# EAGLE design bms (EAGLE 4.13)
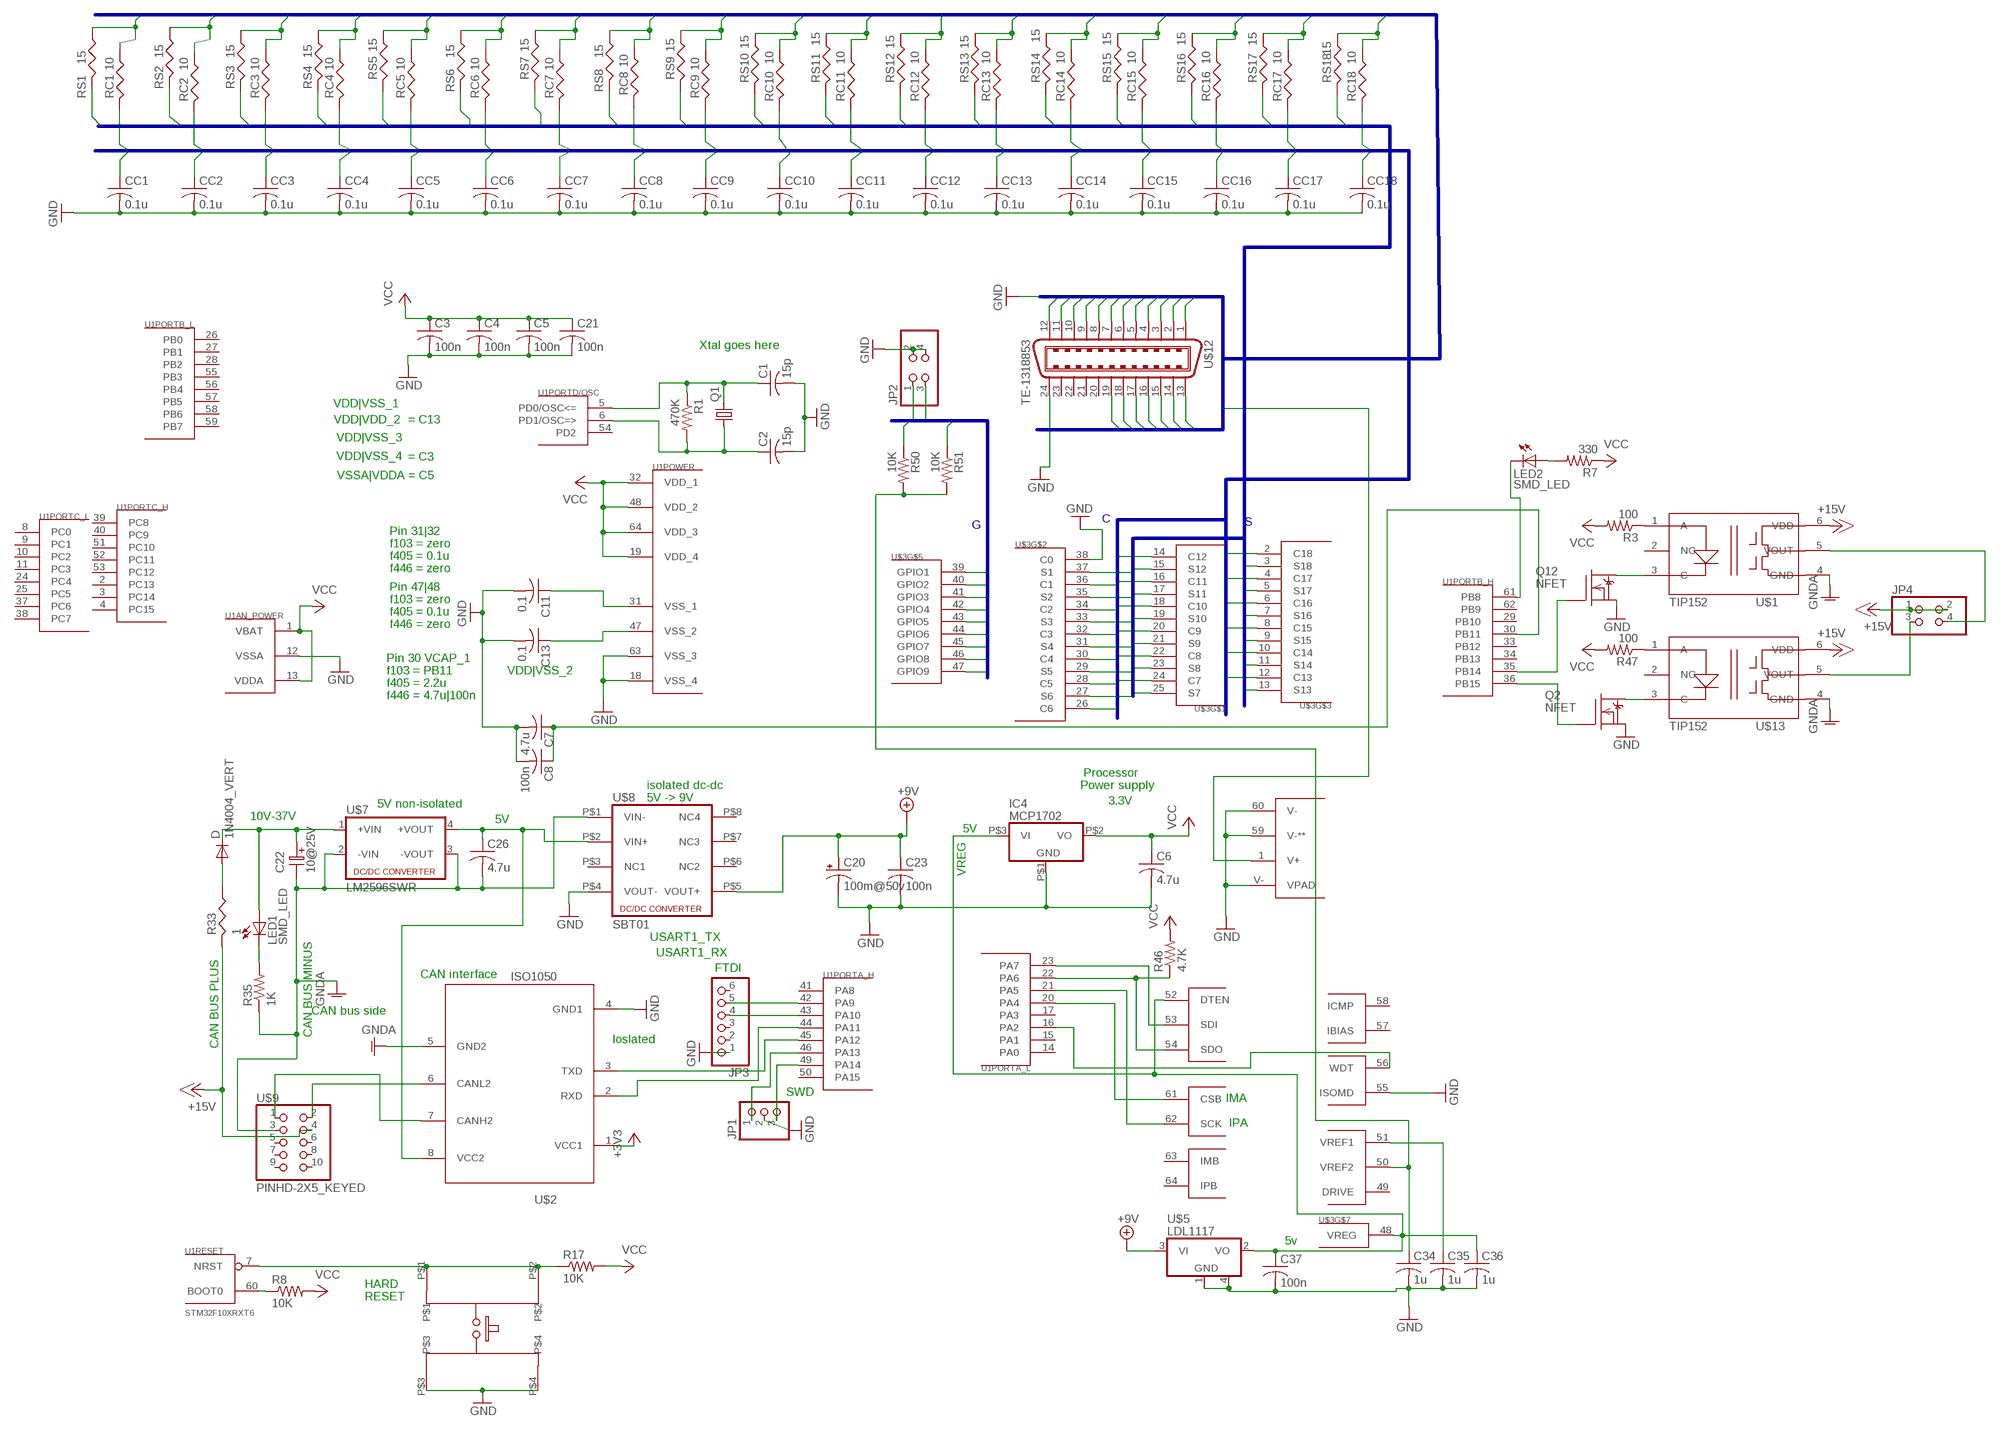
[diagram p0: schematic, sheet 1]

## Parts
C1  15p  C-USC0603  [C0603]
C2  15p  C-USC0603  [C0603]
C3  100n  C-USC0603  [C0603]
C4  100n  C-USC0603  [C0603]
C5  100n  C-USC0603  [C0603]
C6  4.7u  C-USC0805  [C0805]
C7  4.7u  C-USC0603  [C0603]
C8  100n  C-USC0603  [C0603]
C11  0.1  C-USC0603  [C0603]
C13  0.1  C-USC0603  [C0603]
C20  100m@50v  CPOL-USE5-8.5  [E5-8,5]
C21  100n  C-USC0603  [C0603]
C22  10@25V  ELC-2,5L  [ES-2,5L]
C23  100n  C-USC0603  [C0603]
C26  4.7u  C-USC0603  [C0603]
C34  1u  C-USC0603  [C0603]
C35  1u  C-USC0603  [C0603]
C36  1u  C-USC0603  [C0603]
C37  100n  C-USC0603  [C0603]
CC1  0.1u  C-USC0805  [C0805]
CC2  0.1u  C-USC0805  [C0805]
CC3  0.1u  C-USC0805  [C0805]
CC4  0.1u  C-USC0805  [C0805]
CC5  0.1u  C-USC0805  [C0805]
CC6  0.1u  C-USC0805  [C0805]
CC7  0.1u  C-USC0805  [C0805]
CC8  0.1u  C-USC0805  [C0805]
CC9  0.1u  C-USC0805  [C0805]
CC10  0.1u  C-USC0805  [C0805]
CC11  0.1u  C-USC0805  [C0805]
CC12  0.1u  C-USC0805  [C0805]
CC13  0.1u  C-USC0805  [C0805]
CC14  0.1u  C-USC0805  [C0805]
CC15  0.1u  C-USC0805  [C0805]
CC16  0.1u  C-USC0805  [C0805]
CC17  0.1u  C-USC0805  [C0805]
CC18  0.1u  C-USC0805  [C0805]
D  1N4004_VERT  [DO41-10_VERT]
IC4  MCP1702  [SOT-23A]
JP1  PINHD-1X3  [1X03]
JP2  PINHD-2X2  [2X02]
JP3  PINHD-1X6  [1X06]
JP4  PINHD-2X2  [2X02]
LED1  SMD_LED  [SMD_LED]
LED2  SMD_LED  [SMD_LED]
Q1  CRYTALHC49S  [HC49/S]
Q2  NFET  DMN3404L  [SOT-23]
Q12  NFET  DMN3404L  [SOT-23]
R1  470K  R-US_R0603  [R0603]
R3  100  R-US_R0603  [R0603]
R7  330  R-US_R0603  [R0603]
R8  10K  R-US_R0603  [R0603]
R17  10K  R-US_R0603  [R0603]
R33  1  RESUS-S2,5  [RS-2,5]
R35  1K  R-US_R0603  [R0603]
R46  4.7K  R-US_R0603  [R0603]
R47  100  R-US_R0603  [R0603]
R50  10K  R-US_R0603  [R0603]
R51  10K  R-US_R0603  [R0603]
RC1  10  RESUS-S2,5  [RS-2,5]
RC2  10  RESUS-S2,5  [RS-2,5]
RC3  10  RESUS-S2,5  [RS-2,5]
RC4  10  RESUS-S2,5  [RS-2,5]
RC5  10  RESUS-S2,5  [RS-2,5]
RC6  10  RESUS-S2,5  [RS-2,5]
RC7  10  RESUS-S2,5  [RS-2,5]
RC8  10  RESUS-S2,5  [RS-2,5]
RC9  10  RESUS-S2,5  [RS-2,5]
RC10  10  RESUS-S2,5  [RS-2,5]
RC11  10  RESUS-S2,5  [RS-2,5]
RC12  10  RESUS-S2,5  [RS-2,5]
RC13  10  RESUS-S2,5  [RS-2,5]
RC14  10  RESUS-S2,5  [RS-2,5]
RC15  10  RESUS-S2,5  [RS-2,5]
RC16  10  RESUS-S2,5  [RS-2,5]
RC17  10  RESUS-S2,5  [RS-2,5]
RC18  10  RESUS-S2,5  [RS-2,5]
RS1  15  RESUS-S2,5  [RS-2,5]
RS2  15  RESUS-S2,5  [RS-2,5]
RS3  15  RESUS-S2,5  [RS-2,5]
RS4  15  RESUS-S2,5  [RS-2,5]
RS5  15  RESUS-S2,5  [RS-2,5]
RS6  15  RESUS-S2,5  [RS-2,5]
RS7  15  RESUS-S2,5  [RS-2,5]
RS8  15  RESUS-S2,5  [RS-2,5]
RS9  15  RESUS-S2,5  [RS-2,5]
RS10  15  RESUS-S2,5  [RS-2,5]
RS11  15  RESUS-S2,5  [RS-2,5]
RS12  15  RESUS-S2,5  [RS-2,5]
RS13  15  RESUS-S2,5  [RS-2,5]
RS14  15  RESUS-S2,5  [RS-2,5]
RS15  15  RESUS-S2,5  [RS-2,5]
RS16  15  RESUS-S2,5  [RS-2,5]
RS17  15  RESUS-S2,5  [RS-2,5]
RS18  15  RESUS-S2,5  [RS-2,5]
SW1  E-SWITCH  [E-SWITCH]
U1  STM32F10XRXT6  [TQFP64]
U$1  TIP152  SI826  [SDIP6]
U$2  ISO1050  [PDSO-G8]
U$3  LTC6813  [TQFP64_PAD]
U$5  LDL1117  [SO223]
U$7  LM2596SWR  [LM2596SW]
U$8  SBT01  [SBT01]
U$9  PINHD-2X5_KEYED  [2X05_KEYED]
U$12  TE-1318853  [TE-CONN-24]
U$13  TIP152  SI826  [SDIP6]

## Nets
5V_CANSIDE: C26.1 U$2.8(VCC2) U$7.4(+VOUT) U$8.P$2(VIN+)
+3V3: U$2.1(VCC1)
+9V: C20.+ C23.1 U$5.3(VI) U$8.P$5(VOUT+)
+12V_RESISTORED: D.A R33.1
+15V: JP4.1 JP4.2 R33.2 U$1.6(VDD) U$9.4 U$13.6(VDD)
BOOT0: R8.1 U1.60(RESET:BOOT0)
C1: CC1.1 RC1.2 U$3.36(C1)
C2: CC2.1 RC2.2 U$3.34(C2)
C3: CC3.1 RC3.2 U$3.32(C3)
C4: CC4.1 RC4.2 U$3.30(C4)
C5: CC5.1 RC5.2 U$3.28(C5)
C6: CC6.1 RC6.2 U$3.26(C6)
C7: CC7.1 RC7.2 U$3.24(C7)
C8: CC8.1 RC8.2 U$3.22(C8)
C9: CC9.1 RC9.2 U$3.20(C9)
C10: CC10.1 RC10.2 U$3.18(C10)
C11: CC11.1 RC11.2 U$3.16(C11)
C12: CC12.1 RC12.2 U$3.14(C12)
C13: CC13.1 RC13.2 U$3.12(C13)
C14: CC14.1 RC14.2 U$3.10(C14)
C15: CC15.1 RC15.2 U$3.8(C15)
C16: CC16.1 RC16.2 U$3.6(C16)
C17: CC17.1 RC17.2 U$3.4(C17)
C18: CC18.1 RC18.2 U$3.2(C18)
CAN_PROTECTED+: C22.1 D.C LED1.A U$7.1(+VIN)
CANH: U$2.7(CANH2) U$9.1
CANL: U$2.6(CANL2) U$9.2
G1: JP2.1 R50.1 U$3.39(GPIO1)
G2: JP2.3 R51.1 U$3.40(GPIO2)
G3: U$3.41(GPIO3)
G4: U$3.42(GPIO4)
G5: U$3.43(GPIO5)
G6: U$3.44(GPIO6)
G7: U$3.45(GPIO7)
G8: U$3.46(GPIO8)
G9: U$3.47(GPIO9)
GND: C1.2 C2.2 C3.2 C4.2 C5.2 C6.2 C7.2 C8.2 C11.2 C13.2 C20.- C21.2 C23.2 C34.2 C35.2 C36.2 C37.2 CC1.2 CC2.2 CC3.2 CC4.2 CC5.2 CC6.2 CC7.2 CC8.2 CC9.2 CC10.2 CC11.2 CC12.2 CC13.2 CC14.2 CC15.2 CC16.2 CC17.2 CC18.2 IC4.P$1(GND) JP1.2 JP2.2 JP2.4 JP3.1 Q2.2(S) Q12.2(S) SW1.P$3 SW1.P$4 U1.12(AN_POWER:VSSA) U1.18(POWER:VSS_4) U1.63(POWER:VSS_3) U$2.4(GND1) U$3.38(C0) U$3.55(ISOMD) U$3.59(V-**) U$3.60(V-) U$3.V-(VPAD) U$5.1(GND) U$5.4(GND1) U$8.P$4(VOUT-) U$12.24
GNDA: C22.2 C26.2 R35.1 U$1.4(GND) U$2.5(GND2) U$7.2(-VIN) U$7.3(-VOUT) U$8.P$1(VIN-) U$9.3 U$13.4(GND)
JTCK: JP1.3 U1.49(PORTA_H:PA14)
JTMS: JP1.1 U1.46(PORTA_H:PA13)
LED_BUS_PWR: LED1.C R35.2
LED|R: LED2.A R7.2
N$3: JP4.3 U$13.5(VOUT)
N$8: JP4.4 U$1.5(VOUT)
N$10: R3.1 U$1.1(A)
N$11: R47.1 U$13.1(A)
N$12: Q12.3(D) U$1.3(C)
N$13: Q2.3(D) U$13.3(C)
N$14: Q2.1(G) U1.36(PORTB_H:PB15)
N$15: Q12.1(G) U1.35(PORTB_H:PB14)
NRST: R17.1 SW1.P$1 SW1.P$2 U1.7(RESET:NRST)
PA2|WDT: U1.16(PORTA_L:PA2) U$3.56(WDT)
PA9_USART1_TX: JP3.5 U1.42(PORTA_H:PA9)
PA10_USART1_RX: JP3.4 U1.43(PORTA_H:PA10)
PA11_CANRXD: U1.44(PORTA_H:PA11) U$2.2(RXD)
PA12-CANTXD: U1.45(PORTA_H:PA12) U$2.3(TXD)
PB8|LED: LED2.C U1.61(PORTB_H:PB8)
PB11|VCAP: C7.1 C8.1 U1.30(PORTB_H:PB11)
PD0_OSC_IN_XTAL: C1.1 Q1.2 R1.1 U1.5(PORTD/OSC:PD0/OSC<=)
PD1_OSC_OUT: C2.1 Q1.1 R1.2 U1.6(PORTD/OSC:PD1/OSC=>)
S1: RS1.2 U$3.37(S1)
S2: RS2.2 U$3.35(S2)
S3: RS3.2 U$3.33(S3)
S4: RS4.2 U$3.31(S4)
S5: RS5.2 U$3.29(S5)
S6: RS6.2 U$3.27(S6)
S7: RS7.2 U$3.25(S7)
S8: RS8.2 U$3.23(S8)
S9: RS9.2 U$3.21(S9)
S10: RS10.2 U$3.19(S10)
S11: RS11.2 U$3.17(S11)
S12: RS12.2 U$3.15(S12)
S13: RS13.2 U$3.13(S13)
S14: RS14.2 U$3.11(S14)
S15: RS15.2 U$3.9(S15)
S16: RS16.2 U$3.7(S16)
S17: RS17.2 U$3.5(S17)
S18: RS18.2 U$3.3(S18)
SP1_MISO-SDO: R46.1 U1.22(PORTA_L:PA6) U$3.54(SDO)
SP1_NSS-CSB: U1.20(PORTA_L:PA4) U$3.61(CSB)
SPI1_MOSI-SDI: U1.23(PORTA_L:PA7) U$3.53(SDI)
SPI1_SCK-CLK: U1.21(PORTA_L:PA5) U$3.62(SCK)
VCC: C3.1 C4.1 C5.1 C6.1 C21.1 IC4.P$2(VO) R3.2 R7.1 R8.2 R17.2 R46.2 R47.2 U1.1(AN_POWER:VBAT) U1.13(AN_POWER:VDDA) U1.19(POWER:VDD_4) U1.32(POWER:VDD_1) U1.48(POWER:VDD_2) U1.64(POWER:VDD_3)
VREF1: C35.1 U$3.51(VREF1)
VREF2: C34.1 R50.2 R51.2 U$3.50(VREF2)
VREG: C36.1 C37.1 IC4.P$3(VI) U$3.48(VREG) U$3.52(DTEN) U$5.2(VO)
VSS_1: C11.1 U1.31(POWER:VSS_1)
VSS_2: C13.1 U1.47(POWER:VSS_2)
X0: U$12.1
X1: RC1.1 RS1.1 U$12.2
X2: RC2.1 RS2.1 U$12.3
X3: RC3.1 RS3.1 U$12.4
X4: RC4.1 RS4.1 U$12.5
X5: RC5.1 RS5.1 U$12.6
X6: RC6.1 RS6.1 U$12.7
X7: RC7.1 RS7.1 U$12.8
X8: RC8.1 RS8.1 U$12.9
X9: RC9.1 RS9.1 U$12.10
X10: RC10.1 RS10.1 U$12.11
X11: RC11.1 RS11.1 U$12.12
X12: RC12.1 RS12.1 U$12.13
X13: RC13.1 RS13.1 U$12.14
X14: RC14.1 RS14.1 U$12.15
X15: RC15.1 RS15.1 U$12.16
X16: RC16.1 RS16.1 U$12.17
X17: RC17.1 RS17.1 U$12.18
X18: RC18.1 RS18.1 U$3.1(V+) U$12.19
Unconnected: JP3.2 JP3.3 JP3.6 U1.2(PORTC_H:PC13) U1.3(PORTC_H:PC14) U1.4(PORTC_H:PC15) U1.8(PORTC_L:PC0) U1.9(PORTC_L:PC1) U1.10(PORTC_L:PC2) U1.11(PORTC_L:PC3) U1.14(PORTA_L:PA0) U1.15(PORTA_L:PA1) U1.17(PORTA_L:PA3) U1.24(PORTC_L:PC4) U1.25(PORTC_L:PC5) U1.26(PORTB_L:PB0) U1.27(PORTB_L:PB1) U1.28(PORTB_L:PB2) U1.29(PORTB_H:PB10) U1.33(PORTB_H:PB12) U1.34(PORTB_H:PB13) U1.37(PORTC_L:PC6) U1.38(PORTC_L:PC7) U1.39(PORTC_H:PC8) U1.40(PORTC_H:PC9) U1.41(PORTA_H:PA8) U1.50(PORTA_H:PA15) U1.51(PORTC_H:PC10) U1.52(PORTC_H:PC11) U1.53(PORTC_H:PC12) U1.54(PORTD/OSC:PD2) U1.55(PORTB_L:PB3) U1.56(PORTB_L:PB4) U1.57(PORTB_L:PB5) U1.58(PORTB_L:PB6) U1.59(PORTB_L:PB7) U1.62(PORTB_H:PB9) U$1.2(NC) U$3.57(IBIAS) U$3.58(ICMP) U$3.63(IMB) U$3.64(IPB) U$8.P$3(NC1) U$8.P$6(NC2) U$8.P$7(NC3) U$8.P$8(NC4) U$9.5 U$9.6 U$9.7 U$9.8 U$9.9 U$9.10 U$12.20 U$12.21 U$12.22 U$12.23 U$13.2(NC)

## Buses
G[1..9]
C[0..18]
X[1..18],GND
S[1..18]

## Notes on the sheet
- Xtal goes here
- VDD|VSS_1
- VDD|VDD_2 | = C13
- VDD|VSS_3
- VDD|VSS_4
- = C3
- VSSA|VDDA = C5
- C | S
- G
- Pin 31|32
- f103 = zero
- f405 = 0.1u
- f446 = zero
- Pin 47|48
- f103 = zero
- f405 = 0.1u
- f446 = zero
- Pin 30 VCAP_1
- f103 = PB11 | VDD|VSS_2
- f405 = 2.2u
- f446 = 4.7u|100n
- Processor
- isolated dc-dc | Power supply
- 5V -> 9V | 3.3V
- 5V non-isolated
- 10V-37V | 5V
- 5V
- VREG
- USART1_TX
- CAN BUS PLUS | USART1_RX
- FTDI
- CAN interface
- CAN bus side
- CAN BUS MINUS
- Ioslated
- SWD
- IMA
- IPA
- 5v
- HARD
- RESET

## Power pins joined to a net without a drawn wire
DRIVE: U$3.49(DRIVE)

## Library data of the parts
C1-C8 C11 C13 C21 C23 C26 C34-C37 CC1-CC18 = rcl:C-US: CAPACITOR, American symbol
C20 = rcl:CPOL-US: POLARIZED CAPACITOR, American symbol
C22 = DEH:ELC-2,5L
D = diode:1N4004_VERT
IC4 = linear:MCP1702
JP1 = pinhead:PINHD-1X3: PIN HEADER
JP2 JP4 = pinhead:PINHD-2X2: PIN HEADER
JP3 = pinhead:PINHD-1X6: PIN HEADER
LED1 LED2 = led:SMD_LED
Q1 = crystal:CRYTAL: CRYSTAL
Q2 Q12 = transistor-fet:DMN3404L
R1 R3 R7 R8 R17 R35 R46 R47 R50 R51 = rcl:R-US_: RESISTOR, American symbol
R33 RC1-RC18 RS1-RS18 = DEH:RESUS-S2,5
SW1 = switch-misc:E-SWITCH
U1 = stm32:STM32F10XRXT6: STM32F101/103 64pin LQFP
U$1 U$13 = DEH:SI826
U$2 = texas:ISO1050
U$3 = stm32:LTC6813
U$5 = DEH:LDL1117
U$7 = dc-dc-converter:LM2596SWR
U$8 = dc-dc-converter:SBT01
U$9 = pinhead:PINHD-2X5_KEYED
U$12 = DEH:TE-1318853

## Board
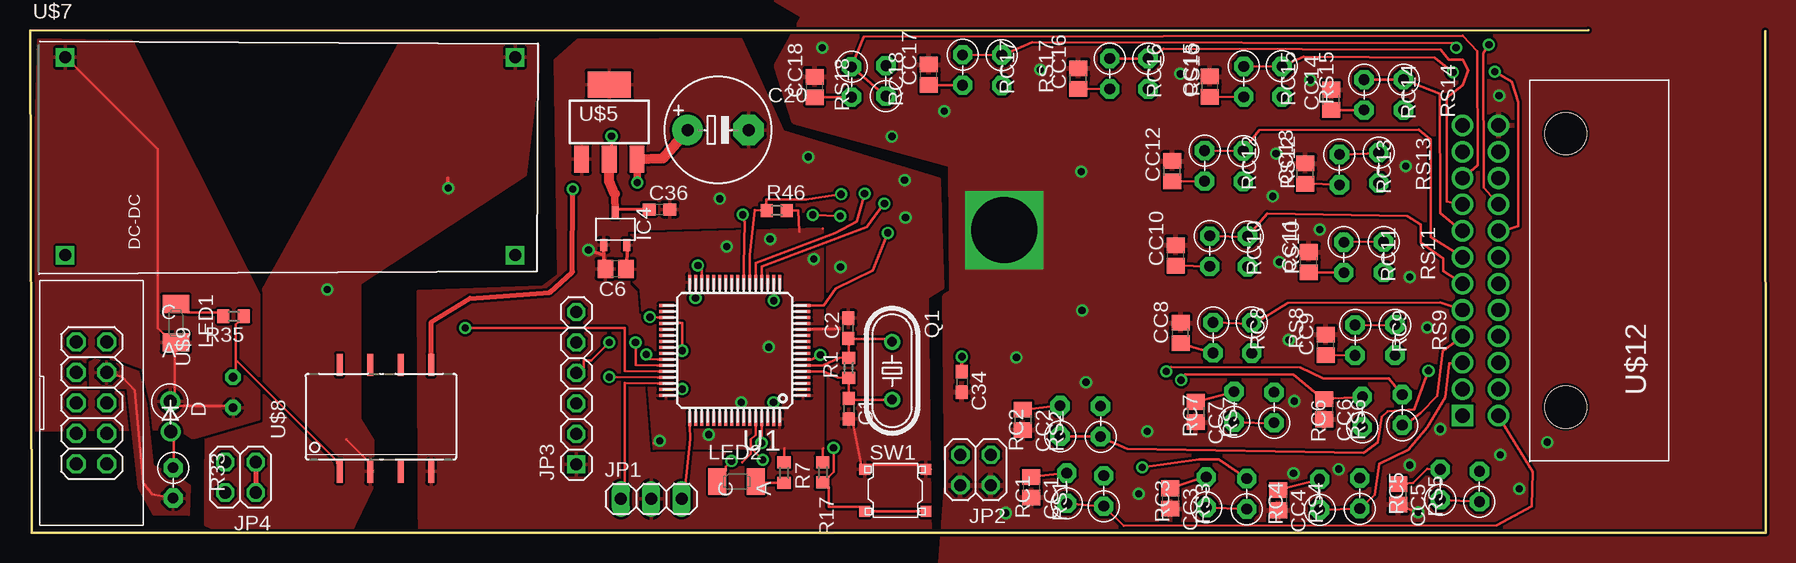
[diagram p1: board, top side]
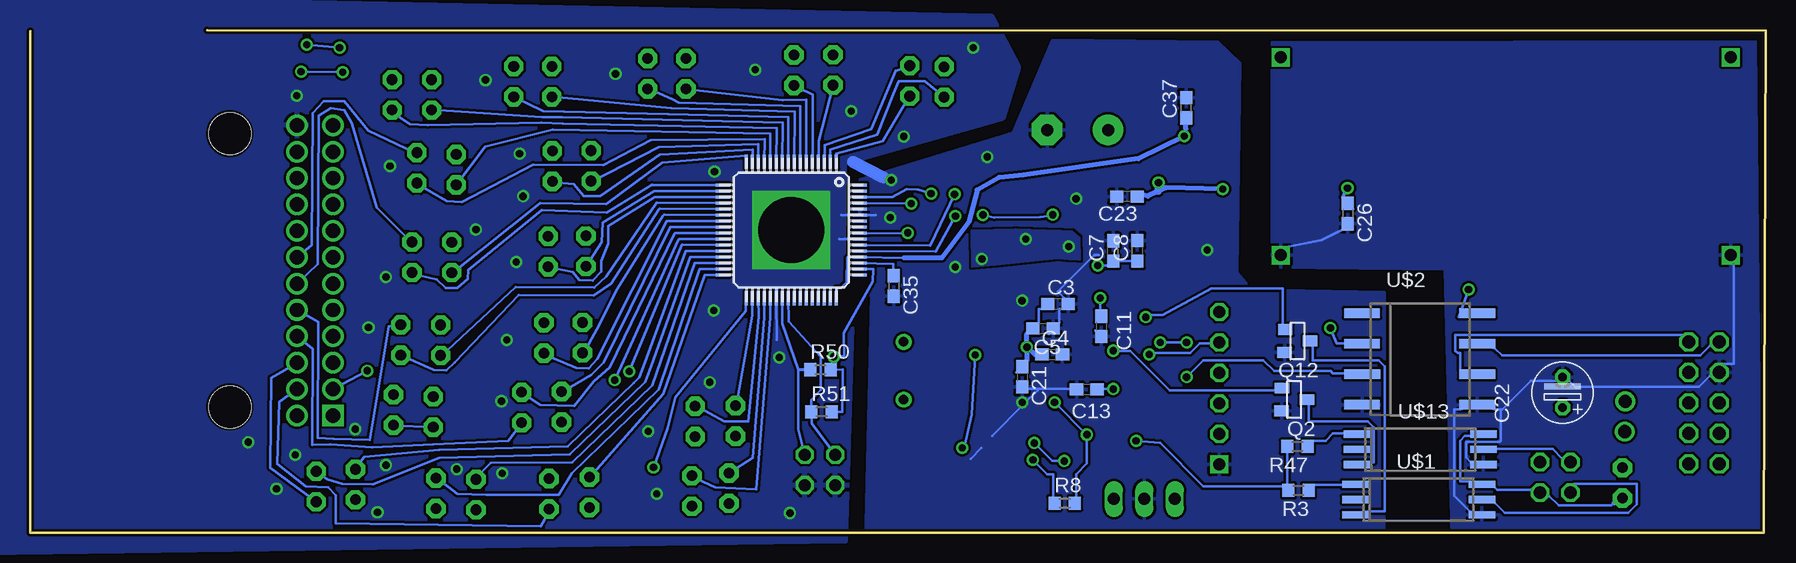
[diagram p2: board, bottom side, seen from below]

Size 144.64 x 41.95 mm. Coordinates in mm from the lower left corner, seen from the top.
Outline: 0,41.87 0.16,0 144.64,0.01 144.61,41.85
Outline: 0,41.87 0,41.7
Outline: 0,41.87 129.87,41.95
Copper layers (1*16): Top 0.035mm / dielectric 1.5mm / Bottom 0.035mm
Design rules "default": minimum track width 8mil, minimum drill 0.6mm, track to track 0.2083mm, track to pad 8mil, pad to pad 8mil, via to via 8mil, smd to smd 0mil, copper to edge 8mil, drill to drill 8mil, minimum pad ring 10mil, minimum via ring 8mil, stop-mask expansion 4mil, vias tented up to drill 0mil, thermal gap 10mil

### Footprints (pad centres in the part's own frame; a part is rotated, then mirrored left to right if it is on the bottom)
C0603 = smd 1.1 x 1: 1 -0.85,0; 2 0.85,0
C0805 = smd 1.3 x 1.5: 1 -0.85,0; 2 0.85,0
E5-8,5 = drill 1 pad 2.54 round: + -2.54,0 | drill 1 pad 2.54 octagon: - 2.54,0
ES-2,5L = drill 0.711 pad 1.27 octagon: 1 0,0; 2 2.54,0
DO41-10_VERT = drill 1.1 round: A 2.58,0.05; C 0.07,0
SOT-23A = smd 0.6 x 1: P$1 -0.95,-1.35; P$2 0.95,-1.35; P$3 0,1.35
1X03 = drill 1 long: 1 -2.54,0; 2 0,0; 3 2.54,0
2X02 = drill 1.016 octagon: 1 -1.27,-1.27; 2 -1.27,1.27; 3 1.27,-1.27; 4 1.27,1.27
1X06 = drill 1 square: 1 -6.35,0 | drill 1 octagon: 2 -3.81,0; 3 -1.27,0; 4 1.27,0; 5 3.81,0; 6 6.35,0
SMD_LED = smd 2.2 x 1.5: A 0,1.6; C 0,-1.6
HC49/S = drill 0.813 round: 1 -2.413,0; 2 2.413,0
SOT-23 = smd 0.9 x 1.2: 1 -1,-1.006; 2 0.9,-1.056; 3 -0.05,1.056
R0603 = smd 1 x 1.1: 1 -0.85,0; 2 0.85,0
RS-2,5 = drill 0.889 pad 1.6 octagon: 1 0,0; 2 2.54,0
E-SWITCH = smd 0.9 x 0.9: P$1 -2.55,1.75; P$2 2.55,1.75; P$3 -2.55,-1.75; P$4 2.55,-1.75
TQFP64 = smd 1.2 x 0.26: 1 -5.7,3.75; 2 -5.7,3.25; 3 -5.7,2.75; 4 -5.7,2.25; 5 -5.7,1.75; 6 -5.7,1.25; 7 -5.7,0.75; 8 -5.7,0.25; 9 -5.7,-0.25; 10 -5.7,-0.75; 11 -5.7,-1.25; 12 -5.7,-1.75; 13 -5.7,-2.25; 14 -5.7,-2.75; 15 -5.7,-3.25; 16 -5.7,-3.75; 33 5.7,-3.75; 34 5.7,-3.25; 35 5.7,-2.75; 36 5.7,-2.25; 37 5.7,-1.75; 38 5.7,-1.25; 39 5.7,-0.75; 40 5.7,-0.25; 41 5.7,0.25; 42 5.7,0.75; 43 5.7,1.25; 44 5.7,1.75; 45 5.7,2.25; 46 5.7,2.75; 47 5.7,3.25; 48 5.7,3.75 | smd 0.26 x 1.2: 17 -3.75,-5.7; 18 -3.25,-5.7; 19 -2.75,-5.7; 20 -2.25,-5.7; 21 -1.75,-5.7; 22 -1.25,-5.7; 23 -0.75,-5.7; 24 -0.25,-5.7; 25 0.25,-5.7; 26 0.75,-5.7; 27 1.25,-5.7; 28 1.75,-5.7; 29 2.25,-5.7; 30 2.75,-5.7; 31 3.25,-5.7; 32 3.75,-5.7; 49 3.75,5.7; 50 3.25,5.7; 51 2.75,5.7; 52 2.25,5.7; 53 1.75,5.7; 54 1.25,5.7; 55 0.75,5.7; 56 0.25,5.7; 57 -0.25,5.7; 58 -0.75,5.7; 59 -1.25,5.7; 60 -1.75,5.7; 61 -2.25,5.7; 62 -2.75,5.7; 63 -3.25,5.7; 64 -3.75,5.7
SDIP6 = smd 0.6 x 2.2: 1 -1.895,-5.33; 2 -0.625,-5.33; 3 0.645,-5.33; 4 0.645,5.22; 5 -0.625,5.22; 6 -1.895,5.22
PDSO-G8 = smd 0.8 x 3: 1 -3.825,-4.8; 2 -1.275,-4.8; 3 1.265,-4.78; 4 3.825,-4.8; 5 3.825,4.8; 6 1.275,4.8; 7 -1.275,4.81; 8 -3.825,4.81
TQFP64_PAD = smd 1.2 x 0.26: 1 -5.7,3.75; 2 -5.7,3.25; 3 -5.7,2.75; 4 -5.7,2.25; 5 -5.7,1.75; 6 -5.7,1.25; 7 -5.7,0.75; 8 -5.7,0.25; 9 -5.7,-0.25; 10 -5.7,-0.75; 11 -5.7,-1.25; 12 -5.7,-1.75; 13 -5.7,-2.25; 14 -5.7,-2.75; 15 -5.7,-3.25; 16 -5.7,-3.75; 33 5.7,-3.75; 34 5.7,-3.25; 35 5.7,-2.75; 36 5.7,-2.25; 37 5.7,-1.75; 38 5.7,-1.25; 39 5.7,-0.75; 40 5.7,-0.25; 41 5.7,0.25; 42 5.7,0.75; 43 5.7,1.25; 44 5.7,1.75; 45 5.7,2.25; 46 5.7,2.75; 47 5.7,3.25; 48 5.7,3.75 | smd 0.26 x 1.2: 17 -3.75,-5.7; 18 -3.25,-5.7; 19 -2.75,-5.7; 20 -2.25,-5.7; 21 -1.75,-5.7; 22 -1.25,-5.7; 23 -0.75,-5.7; 24 -0.25,-5.7; 25 0.25,-5.7; 26 0.75,-5.7; 27 1.25,-5.7; 28 1.75,-5.7; 29 2.25,-5.7; 30 2.75,-5.7; 31 3.25,-5.7; 32 3.75,-5.7; 49 3.75,5.7; 50 3.25,5.7; 51 2.75,5.7; 52 2.25,5.7; 53 1.75,5.7; 54 1.25,5.7; 55 0.75,5.7; 56 0.25,5.7; 57 -0.25,5.7; 58 -0.75,5.7; 59 -1.25,5.7; 60 -1.75,5.7; 61 -2.25,5.7; 62 -2.75,5.7; 63 -3.25,5.7; 64 -3.75,5.7 | smd 5.8 x 5.8: V- 0,0
SO223 = smd 1.219 x 2.235: 1 -2.311,-3.099; 2 0,-3.099; 3 2.311,-3.099 | smd 3.6 x 2.2: 4 0,3.099
LM2596SW = drill 1 square: 1 0,16.5; 2 0,0; 3 37.5,0; 4 37.5,16.5
SBT01 = smd 0.5 x 1.85: P$1 -3.5,-4.63; P$2 -0.96,-4.63; P$3 1.58,-4.63; P$4 4.12,-4.63; P$5 4.12,4.26; P$6 1.58,4.26; P$7 -0.96,4.26; P$8 -3.5,4.26
2X05_KEYED = drill 1.067 octagon: 1 -5.08,-1.27; 2 -5.08,1.27; 3 -2.54,-1.27; 4 -2.54,1.27; 5 0,-1.27; 6 0,1.27; 7 2.54,-1.27; 8 2.54,1.27; 9 5.08,-1.27; 10 5.08,1.27
TE-CONN-24 = drill 1.2 square: 1 12.1,0 | drill 1.2 round: 2 12.1,3; 3 9.9,0; 4 9.9,3; 5 7.7,0; 6 7.7,3; 7 5.5,0; 8 5.5,3; 9 3.3,0; 10 3.3,3; 11 1.1,0; 12 1.1,3; 13 -1.1,0; 14 -1.1,3; 15 -3.3,0; 16 -3.3,3; 17 -5.5,0; 18 -5.5,3; 19 -7.7,0; 20 -7.7,3; 21 -9.9,0; 22 -9.9,3; 23 -12.1,0; 24 -12.1,3 | hole 3.5: 11.4,8.6; -11.4,8.6

### Placement (x,y rotation side)
C1  68.22,10.37 270 top
C2  68.2,17.06 90 top
C3  58.97,19.11 0 bottom
C4  59.45,14.87 0 bottom
C5  60.22,17.04 0 bottom
C6  48.8,22.02 180 top
C7  54.39,23.52 90 bottom
C8  52.35,23.53 90 bottom
C11  55.37,17.23 270 bottom
C13  56.57,11.96 180 bottom
C20  57.34,33.61 0 top
C21  61.97,13.02 270 bottom
C22  16.92,10.45 90 bottom
C23  53.23,28.05 180 bottom
C26  34.83,26.64 270 bottom
C34  77.66,12.6 270 top
C35  72.67,20.6 270 bottom
C36  52.46,26.98 0 top
C37  48.29,35.46 90 bottom
CC1  83.43,3.81 270 top
CC2  82.74,9.43 270 top
CC3  95.02,2.87 270 top
CC4  104.02,2.74 270 top
CC5  114,3.22 270 top
CC6  107.85,10.32 270 top
CC7  97.14,10.08 270 top
CC8  95.88,16.67 90 top
CC9  107.98,15.69 90 top
CC10  95.48,23.15 90 top
CC11  106.57,22.58 90 top
CC12  95.19,30.17 90 top
CC13  106.28,29.97 90 top
CC14  108.43,36.12 90 top
CC15  98.33,37.22 90 top
CC16  87.36,37.9 90 top
CC17  74.9,38.21 90 top
CC18  65.39,37.19 90 top
D  11.69,11.03 270 top
IC4  48.77,25.38 0 top
JP1  51.77,2.83 0 top
JP2  78.8,5.25 180 top
JP3  45.53,12.07 90 top
JP4  17.54,4.64 180 top
LED1  12.16,17.5 180 top
LED2  58.89,4.28 270 top
Q1  71.84,13.53 270 top
Q2  39.29,11.07 270 bottom
Q12  39.03,15.96 270 bottom
R1  68.22,13.76 90 top
R3  38.93,3.55 180 bottom
R7  62.84,5.02 270 top
R8  58.41,2.48 0 bottom
R17  66.07,5.05 90 top
R33  11.93,5.44 270 top
R35  16.97,18.07 180 top
R46  62.23,26.89 0 top
R47  39.02,7.21 180 bottom
R50  78.76,13.61 0 bottom
R51  78.67,10.1 0 bottom
RC1  86.39,2.46 90 top
RC2  85.84,8.07 90 top
RC3  98.02,2.12 90 top
RC4  107.47,1.93 90 top
RC5  117.52,2.77 90 top
RC6  111.03,8.82 90 top
RC7  100.34,9.25 90 top
RC8  98.59,17.55 270 top
RC9  110.42,17.35 270 top
RC10  98.31,24.77 270 top
RC11  109.49,24.25 270 top
RC12  97.88,31.89 270 top
RC13  109.12,31.57 270 top
RC14  111.17,37.81 270 top
RC15  101.15,38.91 270 top
RC16  89.98,39.57 270 top
RC17  77.72,39.88 270 top
RC18  68.46,38.88 270 top
RS1  89.48,2.23 90 top
RS2  89.21,8.03 90 top
RS3  101.39,1.99 90 top
RS4  110.81,2.03 90 top
RS5  120.79,2.6 90 top
RS6  114.35,8.99 90 top
RS7  103.67,9.19 90 top
RS8  101.81,17.54 270 top
RS9  113.75,17.36 270 top
RS10  101.46,24.74 270 top
RS11  112.8,24.26 270 top
RS12  101.11,31.86 270 top
RS13  112.4,31.72 270 top
RS14  114.46,37.81 270 top
RS15  104.33,38.91 270 top
RS16  93.17,39.57 270 top
RS17  80.98,39.86 270 top
RS18  71.33,36.43 90 top
SW1  72.11,3.56 180 top
U1  58.73,15.22 180 top
U$1  28.87,2.16 270 bottom
U$2  28.84,14.51 270 bottom
U$3  81.19,25.27 270 bottom
U$5  48.27,34.29 0 top
U$7  2.92,23.16 0 top
U$8  29.3,9.75 0 top
U$9  5.13,10.84 270 top
U$12  119.38,21.9 270 top
U$13  28.74,6.34 270 bottom

### Tracks (layer width: path | path; a pad name or v marks a point on that pad's centre or on a via)
5V_CANSIDE  (via drill 0.6)
  Top 0.203: 26.36,7.8 28.16,6 U$8.P$2
  Top 0.305: v34.85,28.76 34.87,28.76 34.81,29.59
  Bottom 0.203: 25.46,18.7 U$2.8 25.46,18 25.56,18 v24.76,20.31 | 34.36,27 C26.1 35.26,28
  Bottom 0.305: 35.26,28 v34.85,28.76
  pour Top (rank 3): 17.63,-0.37 26.48,-0.42 28.56,3.92 28.56,7.67 27.49,9.45 27.49,20.86 41.27,29.9 42.34,38.81 42.34,40.66 30.76,40.72 14.67,11.7 14.64,0.69 15.31,0.38
+9V  (via drill 0.6)
  Top 0.406: U$8.P$5 33.45,17.59 36.66,19.57 43.3,20.06 45.19,21.77 v45.24,28.69
  Top 0.61: v50.6,29.21 U$5.3
  Top 0.813: U$5.3 52.75,31.26 54.75,33.57 C20.+
  Bottom 0.203: 51.86,28.2 C23.1
  Bottom 0.406: v45.24,28.69 49.97,28.8 50.6,28.5 51.48,28.08 51.86,28.2
  Bottom 0.61: 50.6,28.5 50.62,28.53 v50.6,29.21
+12V_RESISTORED
  Top 0.203: R33.1 11.96,6.2 11.96,7.7 D.A
+15V
  Top 0.203: JP4.2 18.86,4.1 | U$9.4 7.69,13.03 8.71,11.89 9.42,4.2 10.19,3.24 R33.2
  Top 0.406: 18.86,4.1 18.86,5.2 JP4.1
  Bottom 0.203: U$13.6 24.56,8.1 25.06,8.1 25.46,7.7 25.46,4.3 24.66,4.3 U$1.6 22.56,3.8 22.36,3.6 19.56,3.6 JP4.2 18.06,3.1 17.26,2.3 12.86,2.3 12.66,2.5
  Bottom 0.406: R33.2 12.66,2.5
  pour Top: 6.79,14.25 9,13.44 9.68,10.69 10.22,5.58 12.26,4.68 13.32,3.94 13.24,1.52 10.33,1.55 9.08,3.81 8.13,12.05 5.02,12.18 4.97,14.22 5.41,14.44
BOOT0  (via drill 0.6)
  Top 0.203: 59.36,5.9 60.06,6.6 60.06,7 | 60.06,7 60.06,7.8 60.46,8.2 60.46,9 U1.60 | v61.06,6.1 60.16,7 60.06,7
  Bottom 0.203: v61.06,6.1 59.86,4.9 59.36,4.9 59.36,3 R8.1
C1
  Top 0.203: RC1.2 86.44,5 CC1.1
  Bottom 0.203: U$3.36 83.44,17.99 84.42,6.28 86.37,5 RC1.2
C2
  Top 0.203: RC2.2 CC2.1
  Bottom 0.203: U$3.34 84.44,18.12 85.8,10.59 RC2.2
C3
  Top 0.203: RC3.2 98.02,4.72 CC3.1
  Bottom 0.203: U$3.32 88.43,21.53 91.85,11.59 97.98,4.64 RC3.2
C4
  Top 0.203: RC4.2 107.5,4.49 CC4.1
  Bottom 0.203: U$3.30 89.24,22.52 92.77,12.3 99.45,5.88 106.25,5.83 107.62,4.43 RC4.2
C5
  Top 0.203: CC5.1 115.29,4.17 116.42,5.34 117.59,5.28 RC5.2
  Bottom 0.203: U$3.28 89.99,23.53 89.99,23.52 93.4,14.19 93.87,12.96 94.31,12.52 99.83,7.22 110.52,6.91 116.79,6.36 117.62,5.26 RC5.2
C6  (via drill 0.6)
  Top 0.203: v95.92,12.75 96.25,13.21 105.26,13.24 107.76,11.14 CC6.1 111.06,11.35 RC6.2
  Bottom 0.203: U$3.26 90.54,24.53 90.63,24.45 95.38,13.92 v95.92,12.75
C7
  Top 0.203: RC7.2 100.34,11.77 CC7.1
  Bottom 0.203: U$3.24 91.27,25.53 96.83,14.23 97.86,13.17 100.3,11.78 RC7.2
C8
  Top 0.203: RC8.2 98.65,14.97 CC8.1
  Bottom 0.203: U$3.22 91.78,26.54 91.91,26.42 95.71,20.35 97.41,16.99 98.49,15 RC8.2
C9
  Top 0.203: RC9.2 110.47,14.8 CC9.1
  Bottom 0.203: U$3.20 92.41,27.54 96.6,21.38 97.62,20.47 104.18,20.5 110.42,14.71 RC9.2
C10
  Top 0.203: RC10.2 98.4,22.22 CC10.1
  Bottom 0.203: U$3.18 92.63,28.53 96.93,25.89 97.01,24.26 98.32,22.19 RC10.2
C11
  Top 0.203: RC11.2 109.55,21.71 CC11.1
  Bottom 0.203: U$3.16 84.97,31.46 91.97,30.89 96.63,27.43 102.11,27.51 109.51,21.64 RC11.2
C12
  Top 0.203: RC12.2 97.94,29.34 CC12.1
  Bottom 0.203: U$3.14 83.94,32.41 92.24,32.18 97.81,29.29 RC12.2
C13
  Top 0.203: RC13.2 109.13,29.05 CC13.1
  Bottom 0.203: U$3.12 82.94,33.31 101.08,33.64 106.71,32.21 109.16,28.99 RC13.2
C14
  Top 0.203: RC14.2 111.23,35.28 CC14.1
  Bottom 0.203: U$3.10 81.91,34.22 100.32,34.69 101.95,34.67 111.15,35.29 RC14.2
C15
  Top 0.203: RC15.2 CC15.1
  Bottom 0.203: U$3.8 80.93,35.14 91.22,35.43 101.1,36.38 RC15.2
C16
  Top 0.203: RC16.2 89.95,37.03 CC16.1
  Bottom 0.203: U$3.6 79.96,36.12 81.9,36.11 RC16.2
C17
  Top 0.203: CC17.1 RC17.2
  Bottom 0.203: U$3.4 78.93,32.69 RC17.2
C18
  Top 0.203: RC18.2 CC18.1
  Bottom 0.203: U$3.2 77.96,31.97 74.02,33.23 72.69,36.61 72.23,37.7 70.09,37.68 RC18.2
CAN_PROTECTED+
  Top 0.203: C22.1 16.36,10.6 12.46,10.6 D.C 12.06,11.7 12.06,15.2 LED1.A 11.16,16.6 10.66,17.1 10.66,32 3.66,39 U$7.1
  pour Top (rank 2): -0.22,8.57 12.42,8.66 13.61,7.93 19.07,9.5 19.07,19.87 8.47,40.98 0.74,41.12
CANH
  Bottom 0.203: U$2.7 22.56,15.4 21.96,14.8 5.46,14.8 4.66,15.6 U$9.1
CANL
  Bottom 0.203: U$2.6 25.46,13.6 25.46,15 25.66,15 25.86,15.2 25.86,16.5 6.86,16.5 U$9.2
G1
  Bottom 0.203: U$3.39 81.94,17.47 80.62,13.62 79.78,13.62 R50.1 80.63,13.61 80.62,8.66 80.06,6.46 JP2.1
G2
  Bottom 0.203: U$3.40 81.43,17.64 78.75,14.69 78.73,11.95 79.52,11.11 79.53,10.05 R51.1 79.5,9.14 77.55,6.53 JP2.3
GND  (via drill 0.6, 5.5)
  Top 0.203: C1.2 68.62,9 69.26,5.7 SW1.P$4 69.96,5.7 74.26,5.7 SW1.P$3 75.06,5.3 | 68.62,17.4 C2.2 | 67.42,17.1 67.42,17 64.96,17 U1.12 | v61.96,10.9 61.96,10.1 U1.63 | v61.97,19.37 U1.18 | CC5.2 115.63,1.67
  Top 0.305: C6.2 48.01,22.01 47.81,22.88 IC4.P$1 47.81,23.2 v46.54,23.59
  Bottom 0.203: 60.66,12 61.56,12 C21.2 | 60.66,12 57.96,12 C13.2 | 61.81,10.75 60.66,11.9 60.66,12 | 61.81,10.75 64.46,8.1 | 61.81,10.75 v61.96,10.9 | C11.2 55.86,16.9 | 59.76,16.6 C5.2 58.86,17.5 58.86,18.7 58.66,18.7 C3.2 58.46,19.6 59.01,20.15 55.96,23.2 55.56,23.2 | 65.36,7.1 66.26,6.2 | 82.43,16.1 U$3.38 | 74.17,26.53 U$3.59 77.05,26.53 | U$3.55 77.19,24.52 | v61.97,19.37 61.97,19.35
  Bottom 0.305: v46.54,23.59 46.58,23.59 46.58,23.56
  Bottom 1.016: 73.53,29.64 76.04,30.93
  other vias: 122.53,6.51 105.35,10.99 114.98,21.35 116.43,17.13 114.64,30.6 103.55,28.08 107.48,25.31 88,12.57 126.44,7.57 105.29,4.97 87.67,18.55 87.6,30.15 76.19,35.18 122.42,36.47 106.68,37.78 82.2,14.64 81.19,25.25 72.88,29.44 71.83,33.07 72.96,26.31 124.1,3.69 109.07,5.32 117.53,8.66 115.68,1.71 114.98,5.66 67.54,22.19 93.11,8.48 92.4,3.27 81.31,1.66 104.9,16.1 104.12,22.59 103.84,31.65 95.85,38.29 84.19,38.63 66.03,40.46 57.47,27.87 64.86,31.36
  pour Bottom (rank 4): 76.69,-0.69 154.83,-1.79 154.83,44.99 64.5,43.13 62.26,38.88 63.58,34.56 76.8,30.79 76.89,20.45 76.1,18.64
  pour Top (rank 4): 76.47,-0.07 155.99,-2.51 155.99,46.19 60.91,45.22 64.45,43.09 62.21,39.11 63.72,34.42 76.76,30.81 76.85,20.13 76.25,19.8 76.5,1.36
  pour Top (rank 4): 75.86,-2.48 155.93,-2.62 155.93,46.08 64.39,42.98 62.15,39 63.66,34.31 76.7,30.73 76.79,20.02 76.19,19.69 76.34,4.09
  pour Bottom (rank 4): 31.78,20.06 42.83,20.25 44.09,21.71 43.84,39.17 45.68,40.95 59.4,41.08 62.7,33.33 76.06,29.27 76.03,20.82 74.51,19.81 75.01,-1.02 31.84,-1.79
  pour Top (rank 4): 32.46,-2.68 32.37,20.15 42.73,20.53 44.06,21.53 43.76,39.42 45.64,41.11 59.24,41.2 62.71,33.49 75.76,29.5 76.05,20.46 74.77,19.69 75.02,-0.88
GNDA
  Top 0.203: 17.16,14.3 17.16,13.6 C22.2 | 17.16,14.3 17.16,17.4 17.36,17.6 R35.1 | U$8.P$1 25.56,6 17.26,14.3 17.16,14.3
  Bottom 0.203: U$1.4 24.66,1.8 25.96,3.1 25.96,10.3 25.46,10.3 U$2.5 | 22.06,10.3 22.06,7.7 22.16,7.6 24.96,7.6 24.96,6.3 24.56,5.9 U$13.4 | 22.06,10.3 22.56,10.3 U$2.5 | U$2.5 25.46,11 | 22.06,10.3 21.96,10.3 19.56,12.7 17.46,12.7 C22.2 16.36,12.7 15.86,12.2 5.56,12.2 4.66,13.1 U$9.3 3.46,14.1 2.66,14.1 2.66,22.5 U$7.2 | C26.2 35.26,25.3 36.98,24.45 39.76,23.9 U$7.3
  pour Bottom (rank 4): 26.12,-0.39 26.71,22.01 41.14,22.17 41.14,40.88 0.86,40.96 0.47,-0.14
JTCK
  Top 0.203: U1.49 54.99,8.91 55,7.86 54.59,3.95 JP1.3
JTMS
  Top 0.203: U1.46 52.31,12.48 49.56,12.5 49.56,3.6 JP1.1
LED_BUS_PWR
  Top 0.203: R35.2 15.66,18.4 13.16,18.4 LED1.C
LED|R
  Top 0.203: R7.2 62.36,4.2 61.16,4.2 LED2.A
N$3
  Bottom 0.203: U$13.5 22.46,7 17.76,7 16.96,6.2 JP4.3
N$8
  Bottom 0.203: U$1.5 22.56,2.5 21.76,1.7 11.46,1.7 10.76,2.4 10.76,4.1 15.96,4.1 JP4.4
N$10
  Bottom 0.203: R3.1 37.66,4 35.26,4 U$1.1
N$11
  Bottom 0.203: R47.1 37.76,7.7 36.66,7.7 36.06,8.3 35.16,8.3 U$13.1
N$12
  Bottom 0.203: Q12.3 37.76,15.6 37.76,14.4 32.26,14.4 31.76,13.9 31.76,1.8 33.16,1.8 U$1.3
N$13
  Bottom 0.203: Q2.3 38.06,10.7 38.06,9.3 33.16,9.3 32.66,8.8 32.66,5.9 33.06,5.9 U$13.3
N$14  (via drill 0.6)
  Top 0.203: v54.36,15.2 54.36,17.5 53.56,17.5 U1.36
  Bottom 0.203: Q2.1 40.86,11.9 49.66,11.9 52.96,15.2 v54.36,15.2
N$15  (via drill 0.6)
  Top 0.203: v51.66,18 52.33,17.97 U1.35
  Bottom 0.203: 51.36,17.7 v51.66,18 51.16,18.2 50.26,18.2 46.2,20.37 40.26,20.4 40.26,17.4 Q12.1
NRST  (via drill 0.6)
  Top 0.203: SW1.P$1 74.26,1.8 69.96,1.8 SW1.P$2 69.16,2.2 66.56,2.2 66.56,3.8 R17.1 66.56,4.7 66.96,5.1 v66.96,7.1 | v65.87,14.84 65.16,14.47 U1.7
  Bottom 0.203: v65.87,14.84 66.18,9.9 66.76,7.3 v66.96,7.1
PA2|WDT  (via drill 0.6)
  Top 0.203: U1.16 66.15,18.97 67.16,20.4 70.21,21.88 v71.49,25.03
  Bottom 0.203: U$3.56 75.44,24.98 v71.49,25.03
PA9_USART1_TX  (via drill 0.6)
  Top 0.203: U1.42 52.33,14.47 51.36,14.5 v51.36,14.9
  Bottom 0.203: v51.36,14.9 51.26,15 47.96,15 47.16,15.8 46.26,15.8 JP3.5
PA10_USART1_RX  (via drill 0.6)
  Top 0.203: U1.43 52.27,13.97 50.46,14 v50.46,15.9 | v48.26,15.9 46.76,14.4 46.16,14.4 46.16,13.7 JP3.4
  Bottom 0.203: v48.26,15.9 v50.46,15.9
PA11_CANRXD  (via drill 0.6)
  Top 0.203: U1.44 52.36,13.47 49.56,13.5 49.57,17.1 v36.27,17.09
  Bottom 0.203: U$2.2 35.74,15.8 36.32,17.16 v36.27,17.09
PA12-CANTXD  (via drill 0.6)
  Top 0.203: U1.45 52.3,12.97 v48.26,13
  Bottom 0.203: v48.26,13 46.86,14.4 41.86,14.4 40.96,13.5 36.26,13.5 36.06,13.3 35.06,13.3 U$2.3
PB8|LED  (via drill 0.6)
  Top 0.203: v60.96,7.5 60.96,9 U1.61 | v58.46,6 57.96,5.5 57.96,5.2 LED2.C
  Bottom 0.203: v60.96,7.5 59.46,6 v58.46,6
PB11|VCAP  (via drill 0.6)
  Top 0.203: v55.66,22.3 55.86,22.3 55.96,22.2 55.98,21.54 U1.30
  Bottom 0.203: v55.66,22.3 54.86,22.3 C7.1 53.96,22.7 52.66,22.7 C8.1
PD0_OSC_IN_XTAL
  Top 0.203: U1.5 65.29,13.47 66.12,13.46 67.31,12.96 68.25,12.9 R1.1 C1.1 68.62,11.1 71.24,11.1 Q1.2
PD1_OSC_OUT
  Top 0.203: Q1.1 71.24,16.2 68.62,16.2 C2.1 68.22,15.7 R1.2 68.26,14.62 67.42,14.59 66.05,13.98 65.93,13.97 U1.6
S1
  Bottom 0.203: U$3.37 82.94,17.99 84.1,3.64 87.52,3.8 89.55,4.73 RS1.2
S2
  Bottom 0.203: U$3.35 83.92,18 84.77,9.29 86.79,9.31 89.21,10.65 RS2.2
S3  (via drill 0.6)
  Top 0.203: v92.68,5.46 97.42,6.12 99.05,6.15 101.43,4.51 RS3.2
  Bottom 0.203: U$3.33 84.98,18.5 90.88,11.32 91.51,8.77 v92.68,5.46
S4
  Bottom 0.203: U$3.31 88.83,22.03 88.88,21.94 92.25,11.99 99.5,4.98 100.57,3.2 106.6,3.2 109.04,3.28 110.7,4.57 RS4.2
S5
  Bottom 0.203: U$3.29 89.62,23.03 89.62,23.02 92.87,13.93 93.36,12.61 99.66,6.54 110.52,6.26 116.06,4.07 118.61,4.08 119.86,4.46 RS5.2
S6  (via drill 0.6)
  Top 0.203: v94.69,13.48 95.09,13.83 105.86,13.79 107.76,12.9 113.24,12.9 RS6.2
  Bottom 0.203: U$3.27 90.27,24.05 90.33,24 94.52,13.9 v94.69,13.48
S7
  Bottom 0.203: U$3.25 90.85,25 90.96,24.95 96.34,13.81 97.65,12.65 99.29,10.59 102.1,10.66 103.7,11.71 RS7.2
S8
  Bottom 0.203: U$3.23 91.56,26.03 91.59,26 97.37,14.51 98.08,13.74 99.12,13.77 101.79,14.9 RS8.2
S9
  Bottom 0.203: U$3.21 92.16,27.04 92.25,26.96 96.22,20.81 97.65,19.79 103.92,19.84 109.25,14.23 109.95,13.57 110.98,13.59 113.77,14.85 RS9.2
S10
  Bottom 0.203: U$3.19 92.56,28.01 96.44,25.58 96.46,24.13 97.05,22.7 97.05,21.81 97.76,21.07 98.87,21.09 99.41,21.78 101.47,22.18 RS10.2
S11
  Bottom 0.203: U$3.17 92.8,29.03 92.8,29.04 96.57,26.74 102.01,26.94 108.1,21.92 108.15,21.19 109.04,20.41 110.01,20.45 110.75,21.14 112.88,21.65 RS11.2
S12
  Bottom 0.203: U$3.15 84.41,31.98 92.14,31.56 97.1,28.1 98.51,28.09 99.34,29.09 101.12,29.28 RS12.2
S13
  Bottom 0.203: U$3.13 83.43,32.85 92.91,32.77 96.88,30.69 102.71,30.74 108.68,27.58 109.91,27.67 112.49,29.2 RS13.2
S14
  Bottom 0.203: U$3.11 82.44,30.99 82.41,33.76 100.25,34.13 102.02,34.22 111.48,34.02 112.98,34.09 114.58,35.17 RS14.2
S15
  Bottom 0.203: U$3.9 81.45,34.67 91.47,34.92 100.12,35.13 101.87,35.18 104.36,36.39 RS15.2
S16
  Bottom 0.203: U$3.7 80.44,35.61 90.56,35.87 91.13,36.16 92.53,36.81 93.16,36.93 RS16.2
S17
  Bottom 0.203: RS17.2 79.67,36.7 79.42,36.55 U$3.5
S18
  Bottom 0.203: U$3.3 78.42,30.98 78.42,32.34 74.55,33.69 72.49,38.54 71.41,38.85 RS18.2
SP1_MISO-SDO  (via drill 0.6)
  Top 0.203: U1.22 59.98,21.5 59.97,23.16 60.38,26.92 61.23,26.87 R46.1 61.35,26.82 61.34,27.82 64.65,27.8 v67.59,28.25
  Bottom 0.203: U$3.54 69.63,23.97 v67.59,28.25
SP1_NSS-CSB  (via drill 0.6)
  Top 0.203: U1.20 60.97,22.21 69.72,25.52 71.18,27.51 v71.2,27.48
  Bottom 0.203: v71.2,27.48 71.14,27.46 U$3.61
SPI1_MOSI-SDI  (via drill 0.6)
  Top 0.203: v59.4,26.54 59.58,25.91 59.46,22.3 59.48,21.5 U1.23 | v65.23,26.53 v67.52,26.43
  Bottom 0.203: U$3.53 69.16,23.48 v67.52,26.43 | v65.23,26.53 64.27,26.29 60.47,26.33 59.85,26.41 v59.4,26.54
SPI1_SCK-CLK  (via drill 0.6)
  Top 0.203: U1.21 60.47,22.53 67.12,25.02 68.89,25.98 v69.55,28.3
  Bottom 0.203: U$3.62 72.78,28.01 71.59,28.68 70.66,28.64 70.61,28.63 v69.55,28.3
VCC  (via drill 0.6)
  Top 0.203: R7.1 62.86,6.3 62.86,7 62.86,7.06 | R17.2 66.06,6.4 66.06,7 66.12,7.07 | v52.47,7.68 51.96,7.5 | 66.06,25.37 66.06,25.4 | R46.2 64.04,26.9 64.1,25.14
  Top 0.305: IC4.P$2 49.76,23.2 49.65,22.13 C6.1
  Bottom 0.203: C3.1 60.36,18.7 60.56,18.7 60.56,17.5 C5.1 61.56,16.6 | 61.56,14.4 C21.1 62.46,13.4 | v59.26,10.9 v56.56,8.2 56.56,5.8 57.46,4.9 57.46,3 R8.2 | R47.2 39.86,6.7 39.86,4 R3.2 40.26,3.9 46.86,3.9 50.46,7.5 v52.47,7.68
  Bottom 0.406: v61.56,15.5 61.56,16.6 | v61.56,15.5 61.56,14.4 | C4.1 60.89,14.85 61.51,15.44 v61.56,15.5
  other vias: 58.07,23.89 61.67,24.52 65.31,22.84
  pour Top (rank 2): 51.63,24.99 50.11,24.85 50.09,21.11 50.9,20.31 51.97,7.02 66.12,7.07 66.08,25.37
  pour Bottom (rank 2): 57.21,24.59 57.18,22.8 58.05,22.85 58.98,22.94 64.16,22.38 66.11,22.23 66.16,25.22 62.49,25.3 58.73,25.2 57.81,25.14
VREF1
  Bottom 0.203: U$3.51 72.71,22.42 72.67,21.56 C35.1
VREF2  (via drill 0.6)
  Top 0.305: v77.66,14.7 C34.1
  Bottom 0.203: R51.2 77.64,10.11 76.95,10.11 76.93,13.62 R50.2 77.62,14.36 v77.66,14.7 | U$3.50 74.38,22.03 74.39,20.97 76.83,16.7 76.8,14.66 76.83,14.7
  Bottom 0.305: v77.66,14.7 76.83,14.7
VREG  (via drill 0.6)
  Top 0.203: v48.46,33.1 48.46,32.3 U$5.2
  Top 0.305: IC4.P$3 48.63,27.02 C36.1
  Top 0.61: IC4.P$3 48.79,26.65 48.74,28.28
  Top 0.813: U$5.2 48.25,29.34 48.74,28.28
  Bottom 0.203: 48.86,33.2 48.31,33.7 48.66,33.3 v48.46,33.1 | 48.31,34.51 C37.1 | U$3.48 77.45,19.62 77.45,20.41 77.06,20.41 76.57,20.94 76.55,22.98 U$3.52 71.8,22.95
  Bottom 0.406: 48.31,33.7 48.31,34.51 | 71.8,22.95 68.66,22.94 66.42,25.91 65.72,28.61 63.87,29.64 61.85,29.85 52.28,31.21 v48.45,33.09 v48.46,33.1
VSS_1  (via drill 0.6)
  Top 0.203: v55.46,19.6 55.46,20.4 U1.31
  Bottom 0.203: v55.46,19.6 55.46,18.6 C11.1
VSS_2  (via drill 0.6)
  Top 0.203: v54.36,12 53.56,12 U1.47
  Bottom 0.203: v54.36,12 55.26,12 C13.1
X1
  Top 0.203: RC1.1 89.58,2.19 RS1.1 91.13,0.61 122.24,0.63 125.15,2.23 125.22,5.1 122.34,9.76 U$12.2
X2  (via drill 0.6)
  Top 0.203: RC2.1 89.25,8.05 RS2.1 89.26,7.97 91.42,7.03 111.13,6.67 112.31,7.57 112.65,9.66 113.16,10.15 115.34,10.31 v116.54,13.53
  Bottom 0.203: v116.54,13.53 U$12.3
X3
  Top 0.203: RC3.1 98,2.13 RS3.1
  Bottom 0.203: U$12.4 123.88,10.91 124.04,5.78 121.65,3.87 119.78,3.8 119.15,3.12 119.15,0.8 102.09,0.55 101.38,1.79 RS3.1
X4
  Top 0.203: U$12.5 118.29,14.15 117.94,11.29 116.43,8.79 114.86,6.95 112.42,5.78 112.08,3.2 110.86,2.05 RS4.1 110.84,2 RC4.1
X5
  Top 0.203: RS5.1 RC5.1
  Bottom 0.203: U$12.6 124.55,12.95 124.6,5.44 120.84,2.62 RS5.1
X6
  Top 0.203: U$12.7 117.74,15.16 117.25,11.44 115.9,10.03 114.38,8.84 RS6.1
  Bottom 0.203: RS6.1 114.31,8.96 RC6.1
X7
  Top 0.203: RS7.1 103.72,9.08 RC7.1
  Bottom 0.203: U$12.8 121.07,15.36 121.11,7.36 119.62,7.4 116.13,7.13 111.03,7.4 104.8,7.68 103.7,9.09 RS7.1
X8
  Top 0.203: RC8.1 101.88,17.41 RS8.1 101.85,17.35 104.83,19.2 117.54,19.22 U$12.9
X9
  Top 0.203: RS9.1 113.83,17.32 RC9.1
  Bottom 0.203: U$12.10 120.61,17.59 120.64,7.95 119.32,7.86 116.34,7.76 114.76,17.22 RS9.1 113.69,17.36
X10
  Top 0.203: RC10.1 101.53,24.67 RS10.1 101.39,24.65 103.1,26.65 114.79,26.43 115.9,25.74 115.88,24.21 117.77,22.9 117.77,21.85 U$12.11
X11
  Top 0.203: RS11.1 112.93,24.31 RC11.1
  Bottom 0.203: U$12.12 120.67,22.44 120.59,34.79 119.56,35.42 118.47,35.25 117.83,34.19 115.75,27.12 112.81,24.21 RS11.1
X12
  Top 0.203: RC12.1 101.14,31.86 RS12.1 100.98,31.75 102.44,33.59 115.73,33.62 116.72,32.82 116.72,24.7 U$12.13
X13
  Top 0.203: RS13.1 112.59,31.66 RC13.1
  Bottom 0.203: U$12.14 121.14,24.02 121.08,35.01 120.15,36.02 118.47,36.03 116.47,33.55 112.51,31.68 RS13.1
X14
  Top 0.203: RC14.1 114.51,37.82 RS14.1 117.49,36.63 117.51,26.66 119.3,25.2 U$12.15
X15  (via drill 0.6)
  Top 0.203: RC15.1 104.34,38.88 RS15.1 106.16,39.74 117.07,39.65 v118.58,38.44 | v122.05,38.47 123.47,37.62 124.02,35.92 124,25.61 122.4,25.06 U$12.16
  Bottom 0.203: v118.58,38.44 v122.05,38.47
X16
  Top 0.203: RC16.1 RS16.1 94.46,40.37 117.58,40.31 118.23,39.46 119.41,39.49 119.87,38.58 119.38,37.35 118.06,36.3 118.06,27.64 119.43,27.34 U$12.17
  Bottom 0.203: U$12.17 119.38,27.38
X17  (via drill 0.6)
  Top 0.203: RC17.1 RS17.1 80.95,39.81 83.54,40.93 118.56,40.84 v118.84,40.46 | U$12.18 121.14,28.79 121.11,40.02 v121.58,40.72
  Bottom 0.203: v118.84,40.46 v121.58,40.72
X18
  Top 0.203: RS18.1 71.36,36.38 RC18.1 68.45,38.83 69.46,41.38 119.41,41.47 120.6,40.17 120.64,30.69 U$12.19
  Bottom 0.203: U$3.1 77.44,31.63 73.57,32.66 71.39,36.35 RS18.1

### Text on the board
bNames: 5
tValues: 3.3V | DIGITAL | +5V | 3.2v | ANALOG | 3.2